# Altium project FMC_130MSPS.PrjPCB (part 1 of 2)
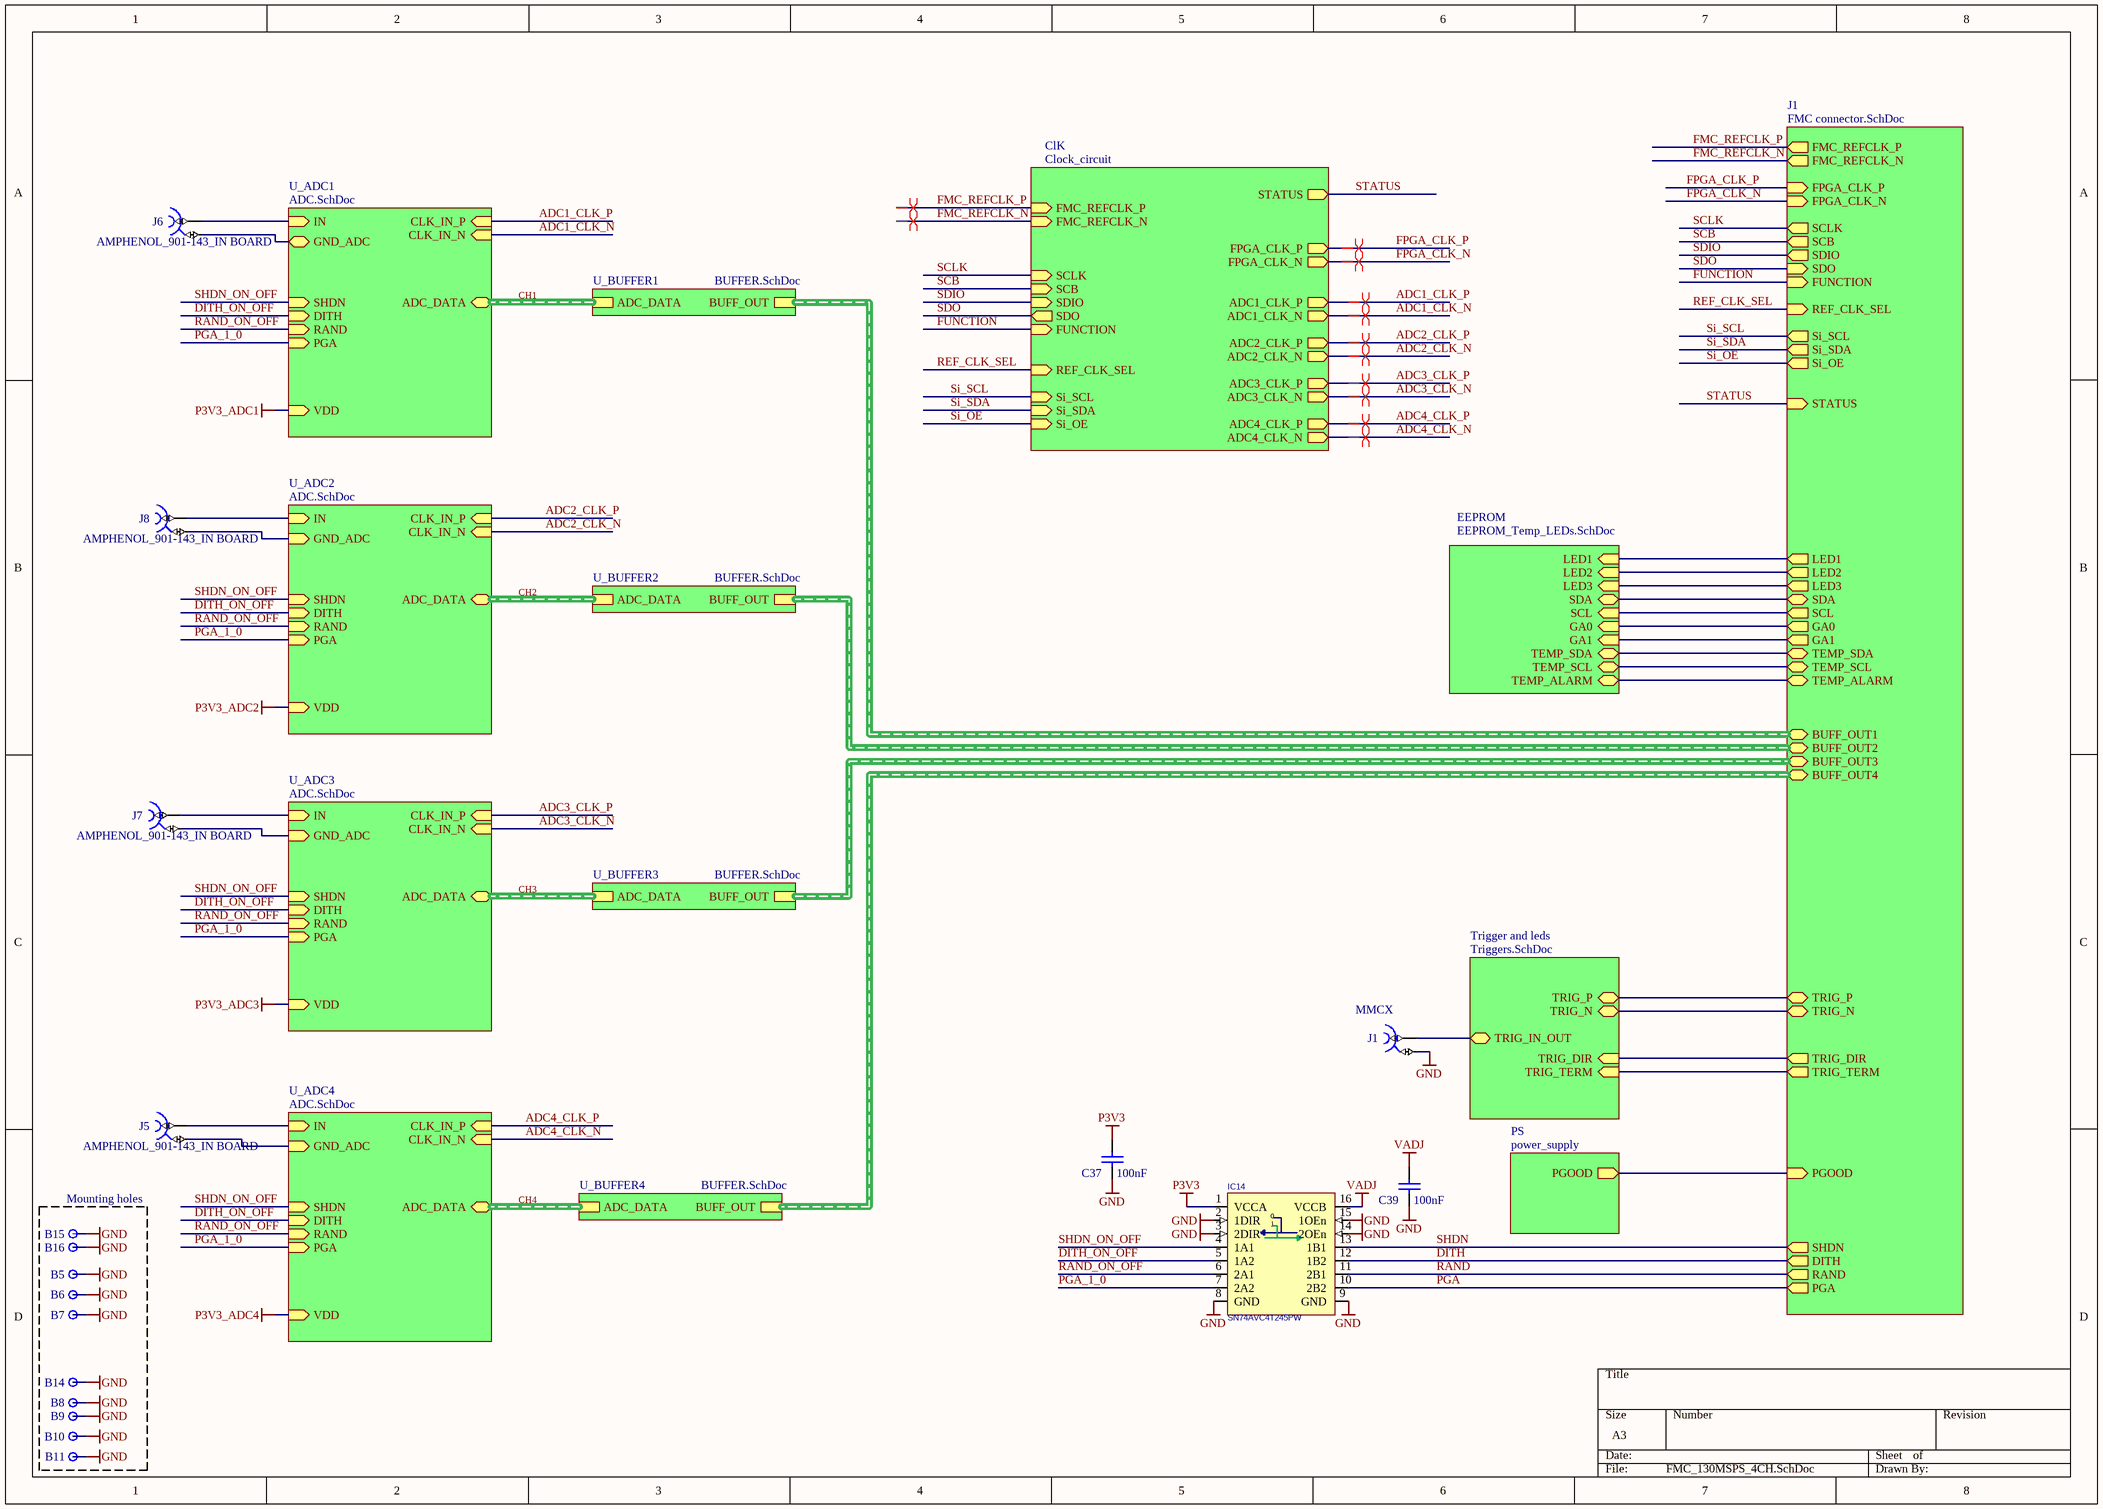
[diagram p0: FMC_130MSPS_4CH.SchDoc]
4 sheets, 294 parts. Net scope: hierarchical (ports join the sheet entries above them; power ports are global).
Board file: FMC_ADC_130M_16B_4CHv4.PcbDoc
Sheets:
  FMC_130MSPS_4CH.SchDoc
    ClK = Clock_circuit.SchDoc
    EEPROM = EEPROM_Temp_LEDs.SchDoc
    U_ADC1 = ADC.SchDoc
    U_ADC2 = ADC.SchDoc
    U_ADC3 = ADC.SchDoc
    U_ADC4 = ADC.SchDoc

## Sheet FMC_130MSPS_4CH.SchDoc
size A3

### Parts
B5  Plated Hole  [MTG240_400]  (value not drawn)  (no BOM)
B6  Plated Hole  [MTG240_400]  (value not drawn)  (no BOM)
B7  Plated Hole  [MTG240_400]  (value not drawn)  (no BOM)
B8  Plated Hole  [MTG240_400]  (value not drawn)  (no BOM)
B9  Plated Hole  [MTG240_400]  (value not drawn)  (no BOM)
B10  Plated Hole  [MTG240_400]  (value not drawn)  (no BOM)
B11  Plated Hole  [MTG240_400]  (value not drawn)  (no BOM)
B14  Plated Hole  [MTG240_400]  (value not drawn)  (no BOM)
B15  Plated Hole  [MTG240_400]  (value not drawn)  (no BOM)
B16  Plated Hole  [MTG240_400]  (value not drawn)  (no BOM)
C37  100nF  [CAPC0603X33N]
C39  100nF  [CAPC0603X33N]
IC14  SN74AVC4T245PW  [TSSOP-16]
J1  Family: MMCX  [HUBER-SUHNER_85_MMCX-50-0-1/111 OH]  (hidden comment: Coax_1Female_1Shield)
J5  AMPHENOL_901-143_IN BOARD  [AMPHENOL_901-143_IN BOARD]
J6  AMPHENOL_901-143_IN BOARD  [AMPHENOL_901-143_IN BOARD]
J7  AMPHENOL_901-143_IN BOARD  [AMPHENOL_901-143_IN BOARD]
J8  AMPHENOL_901-143_IN BOARD  [AMPHENOL_901-143_IN BOARD]

### Blocks framed on the sheet
Mounting holes: B5-B11 B14-B16

### Sub-sheets
ClK = Clock_circuit: FPGA_CLK_P (out), FPGA_CLK_N (out), Si_SDA (in), Si_SCL (in), Si_OE (in), ADC1_CLK_P (out), ADC1_CLK_N (out), ADC2_CLK_P (out), ADC2_CLK_N (out), ADC3_CLK_P (out), ADC3_CLK_N (out), ADC4_CLK_P (out), ADC4_CLK_N (out), SCLK (in), SCB (in), SDIO (in), SDO (out), STATUS (out), FUNCTION (in), FMC_REFCLK_P (in), FMC_REFCLK_N (in), REF_CLK_SEL (in)
EEPROM = EEPROM_Temp_LEDs.SchDoc: LED1 (in), LED2 (in), SDA (bidir), SCL (in), GA0 (in), GA1 (in), LED3 (in), TEMP_SDA (bidir), TEMP_SCL (bidir), TEMP_ALARM (bidir)
J1 = FMC connector.SchDoc (file not in this document): BUFF_OUT1 (harness BUFF_OUT), BUFF_OUT2 (harness BUFF_OUT), BUFF_OUT4 (harness BUFF_OUT), BUFF_OUT3 (harness BUFF_OUT), SHDN (out), DITH (out), RAND (out), PGA (out), PGOOD (in), TRIG_DIR (out), TRIG_TERM (out), FMC_REFCLK_P (out), FMC_REFCLK_N (out), Si_SDA (out), Si_SCL (out), Si_OE (out), SCLK (out), SCB (out), SDIO (out), SDO (in), FUNCTION (in), STATUS (in), FPGA_CLK_P (in), FPGA_CLK_N (in), TRIG_N (bidir), TRIG_P (bidir), REF_CLK_SEL (in), LED1 (out), LED2 (out), SDA (bidir), SCL (out), GA0 (out), GA1 (out), LED3 (out), TEMP_SDA (bidir), TEMP_SCL (bidir), TEMP_ALARM (bidir)
PS = power_supply (file not in this document): PGOOD (out)
Trigger and leds = Triggers.SchDoc (file not in this document): TRIG_DIR (in), TRIG_N (bidir), TRIG_P (bidir), TRIG_TERM (in), TRIG_IN_OUT (bidir)
U_ADC1 = ADC.SchDoc: SHDN (in), IN (in), DITH (in), RAND (in), VDD, CLK_IN_P (in), CLK_IN_N (in), PGA (in), ADC_DATA (harness ADC_DATA), GND_ADC
U_ADC2 = ADC.SchDoc: SHDN (in), IN (in), DITH (in), RAND (in), VDD, CLK_IN_P (in), CLK_IN_N (in), PGA (in), ADC_DATA (harness ADC_DATA), GND_ADC (in)
U_ADC3 = ADC.SchDoc: SHDN (in), IN (in), DITH (in), RAND (in), VDD, CLK_IN_P (in), CLK_IN_N (in), PGA (in), ADC_DATA (harness ADC_DATA), GND_ADC (in)
U_ADC4 = ADC.SchDoc: SHDN (in), IN (in), DITH (in), RAND (in), VDD, CLK_IN_P (in), CLK_IN_N (in), PGA (in), ADC_DATA (harness ADC_DATA), GND_ADC (in)
U_BUFFER1 = BUFFER.SchDoc (file not in this document): BUFF_OUT (harness BUFF_OUT), ADC_DATA (harness ADC_DATA)
U_BUFFER2 = BUFFER.SchDoc (file not in this document): BUFF_OUT (harness BUFF_OUT), ADC_DATA (harness ADC_DATA)
U_BUFFER3 = BUFFER.SchDoc (file not in this document): BUFF_OUT (harness BUFF_OUT), ADC_DATA (harness ADC_DATA)
U_BUFFER4 = BUFFER.SchDoc (file not in this document): BUFF_OUT (harness BUFF_OUT), ADC_DATA (harness ADC_DATA)

### Nets
GND: B5.1 B6.1 B7.1 B8.1 B9.1 B10.1 B11.1 B14.1 B15.1 B16.1 C37.1 C39.1 IC14.2(1DIR) IC14.3(2DIR) IC14.8(GND) IC14.9(GND) IC14.14(2OEn) IC14.15(1OEn) J1.2
P3V3: C37.2 IC14.1(VCCA)
VADJ: C39.2 IC14.16(VCCB)
ADC1_CLK_N: sheet ClK/ADC1_CLK_N, sheet U_ADC1/CLK_IN_N
ADC1_CLK_P: sheet ClK/ADC1_CLK_P, sheet U_ADC1/CLK_IN_P
ADC2_CLK_N: sheet ClK/ADC2_CLK_N, sheet U_ADC2/CLK_IN_N
ADC2_CLK_P: sheet ClK/ADC2_CLK_P, sheet U_ADC2/CLK_IN_P
ADC3_CLK_N: sheet ClK/ADC3_CLK_N, sheet U_ADC3/CLK_IN_N
ADC3_CLK_P: sheet ClK/ADC3_CLK_P, sheet U_ADC3/CLK_IN_P
ADC4_CLK_N: sheet ClK/ADC4_CLK_N, sheet U_ADC4/CLK_IN_N
ADC4_CLK_P: sheet ClK/ADC4_CLK_P, sheet U_ADC4/CLK_IN_P
DITH: IC14.12(1B2) ; sheet J1/DITH
DITH_ON_OFF: IC14.5(1A2) ; sheet U_ADC1/DITH, sheet U_ADC2/DITH, sheet U_ADC3/DITH, sheet U_ADC4/DITH
FMC_REFCLK_N: sheet J1/FMC_REFCLK_N, sheet ClK/FMC_REFCLK_N
FMC_REFCLK_P: sheet J1/FMC_REFCLK_P, sheet ClK/FMC_REFCLK_P
FPGA_CLK_N: sheet J1/FPGA_CLK_N, sheet ClK/FPGA_CLK_N
FPGA_CLK_P: sheet J1/FPGA_CLK_P, sheet ClK/FPGA_CLK_P
FUNCTION: sheet J1/FUNCTION, sheet ClK/FUNCTION
LED1: sheet J1/LED1, sheet EEPROM/LED1
LED2: sheet J1/LED2, sheet EEPROM/LED2
LED3: sheet J1/LED3, sheet EEPROM/LED3
PGA: IC14.10(2B2) ; sheet J1/PGA
PGA_1_0: IC14.7(2A2) ; sheet U_ADC1/PGA, sheet U_ADC2/PGA, sheet U_ADC3/PGA, sheet U_ADC4/PGA
RAND: IC14.11(2B1) ; sheet J1/RAND
RAND_ON_OFF: IC14.6(2A1) ; sheet U_ADC1/RAND, sheet U_ADC2/RAND, sheet U_ADC3/RAND, sheet U_ADC4/RAND
REF_CLK_SEL: sheet J1/REF_CLK_SEL, sheet ClK/REF_CLK_SEL
SCB: sheet J1/SCB, sheet ClK/SCB
SCL: sheet J1/SCL, sheet EEPROM/SCL
SCLK: sheet J1/SCLK, sheet ClK/SCLK
SDA: sheet J1/SDA, sheet EEPROM/SDA
SDIO: sheet J1/SDIO, sheet ClK/SDIO
SDO: sheet J1/SDO, sheet ClK/SDO
SHDN: IC14.13(1B1) ; sheet J1/SHDN
SHDN_ON_OFF: IC14.4(1A1) ; sheet U_ADC1/SHDN, sheet U_ADC2/SHDN, sheet U_ADC3/SHDN, sheet U_ADC4/SHDN
Si_OE: sheet J1/Si_OE, sheet ClK/Si_OE
Si_SCL: sheet J1/Si_SCL, sheet ClK/Si_SCL
Si_SDA: sheet J1/Si_SDA, sheet ClK/Si_SDA
STATUS: sheet J1/STATUS, sheet ClK/STATUS
TEMP_ALARM: sheet J1/TEMP_ALARM, sheet EEPROM/TEMP_ALARM
TEMP_SCL: sheet J1/TEMP_SCL, sheet EEPROM/TEMP_SCL
TEMP_SDA: sheet J1/TEMP_SDA, sheet EEPROM/TEMP_SDA
NetC1A_2: J6.2 ; sheet U_ADC1/GND_ADC
NetC1B_2: J8.2 ; sheet U_ADC2/GND_ADC
NetC1C_2: J7.2 ; sheet U_ADC3/GND_ADC
NetC1D_2: J5.2 ; sheet U_ADC4/GND_ADC
NetIC5_1: sheet J1/GA1, sheet EEPROM/GA1
NetIC5_2: sheet J1/GA0, sheet EEPROM/GA0
NetJ1_1: J1.1 ; sheet Trigger and leds/TRIG_IN_OUT
NetJ5_1: J5.1 ; sheet U_ADC4/IN
NetJ6_1: J6.1 ; sheet U_ADC1/IN
NetJ7_1: J7.1 ; sheet U_ADC3/IN
NetJ8_1: J8.1 ; sheet U_ADC2/IN
(unnamed): sheet PS/PGOOD, sheet J1/PGOOD
(unnamed): sheet J1/TRIG_DIR, sheet Trigger and leds/TRIG_DIR
(unnamed): sheet J1/TRIG_TERM, sheet Trigger and leds/TRIG_TERM
(unnamed): sheet J1/TRIG_N, sheet Trigger and leds/TRIG_N
(unnamed): sheet J1/TRIG_P, sheet Trigger and leds/TRIG_P

### Buses and harness runs
harness CH1 = sheet U_ADC1/ADC_DATA = sheet U_BUFFER1/ADC_DATA
harness CH2 = sheet U_ADC2/ADC_DATA = sheet U_BUFFER2/ADC_DATA
harness CH3 = sheet U_ADC3/ADC_DATA = sheet U_BUFFER3/ADC_DATA
harness CH4 = sheet U_ADC4/ADC_DATA = sheet U_BUFFER4/ADC_DATA
harness sheet J1/BUFF_OUT1 = sheet U_BUFFER1/BUFF_OUT
harness sheet J1/BUFF_OUT2 = sheet U_BUFFER2/BUFF_OUT
harness sheet J1/BUFF_OUT3 = sheet U_BUFFER3/BUFF_OUT
harness sheet J1/BUFF_OUT4 = sheet U_BUFFER4/BUFF_OUT

### Layout directives
differential pair: ADC1_CLK_N, ADC1_CLK_P, ADC2_CLK_N, ADC2_CLK_P, ADC3_CLK_N, ADC3_CLK_P, ADC4_CLK_N, ADC4_CLK_P, FMC_REFCLK_N, FMC_REFCLK_P, FPGA_CLK_N, FPGA_CLK_P

### Notes on the sheet
- (in symbol 74AVC4T245) 0

### Library data of the parts
B5-B11 B14-B16 = PLATED_HOLE2.4_PAD4.0: Single Terminal Socket; Part Description: Plated Through Hole: Hole Dia.=2.4mm Pad Dia.=4.0mm; Mounted: No; Table: Pads; Part Number: PLATED_HOLE2.4_PAD4.0; Component Type: Standard (No BOM); Pin Count: 1; Family: Plated Hole; Socket: No; SMD: No; Status: None; ComponentHeight: 0mm; Author: CERN DEM JMW; CreateDate: 2011-10-10; LatestRevisionDate: 2011-10-10; PackageDescription: Plated Through Hole: Hole Dia.=2.4mm Pad Dia.=4.0mm
C37 C39 = CC0201_100NF_6.3V_10%_X5R: Non-polarised capacitor; Part Description: SMD Multilayer Chip Ceramic Capacitor; Manufacturer: GENERIC; Manufacturer1 Part Number: 02016D104KAT2A; Voltage: 6.3V; TC: X5R; Tolerance: ±10%; Table: Capacitors SMD; Part Number: CC0201_100NF_6.3V_10%_X5R; Component Kind: Standard; Component Type: Standard; Pin Count: 2; Value: 100nF; Status: Not Recommended; Manufacturer Part Number: CC0201_100NF_6.3V_10%_X5R; Case: 0201; Mounted: Yes; Socket: No; SMD: Yes; Manufacturer1 Example: AVX; Manufacturer1 ComponentHeight: 0.33mm; HelpURL: \\cern.ch\dfs\Applications\Altium\Datasheets\CC0201_X5R_AVX.pdf; Author: CERN DEM JLC; CreateDate: 2007-12-03; LatestRevisionDate: 2007-12-03
IC14 = 74AVC4T245: 4-BIT DUAL-SUPPLY BUS TRANSCEIVER
J1 = HUBER-SUHNER_85_MMCX-50-0-1/111 OH: Part Description: MMCX 50 Ohms Right Angle PCB Jack; Manufacturer: HUBER+SUHNER; Table: Miscellaneous; Part Number: HUBER-SUHNER_85_MMCX-50-0-1/111 OH; Component Kind: Standard; Component Type: Standard; Pin Count: 2; Mounted: Yes; Socket: No; SMD: No; Status: None; Manufacturer Part Number: 85_MMCX-50-0-1/111 OH; ComponentHeight: 9.6mm; HelpURL: \\cern.ch\dfs\Applications\Altium\Datasheets\HUBER-SUHNER_85_MMCX-50-0-1-111 OH.pdf; Author: CERN DEM JLC; CreateDate: 4/10/2011; LatestRevisionDate: 4/10/2011

## Sheet Clock_circuit.SchDoc
size A3
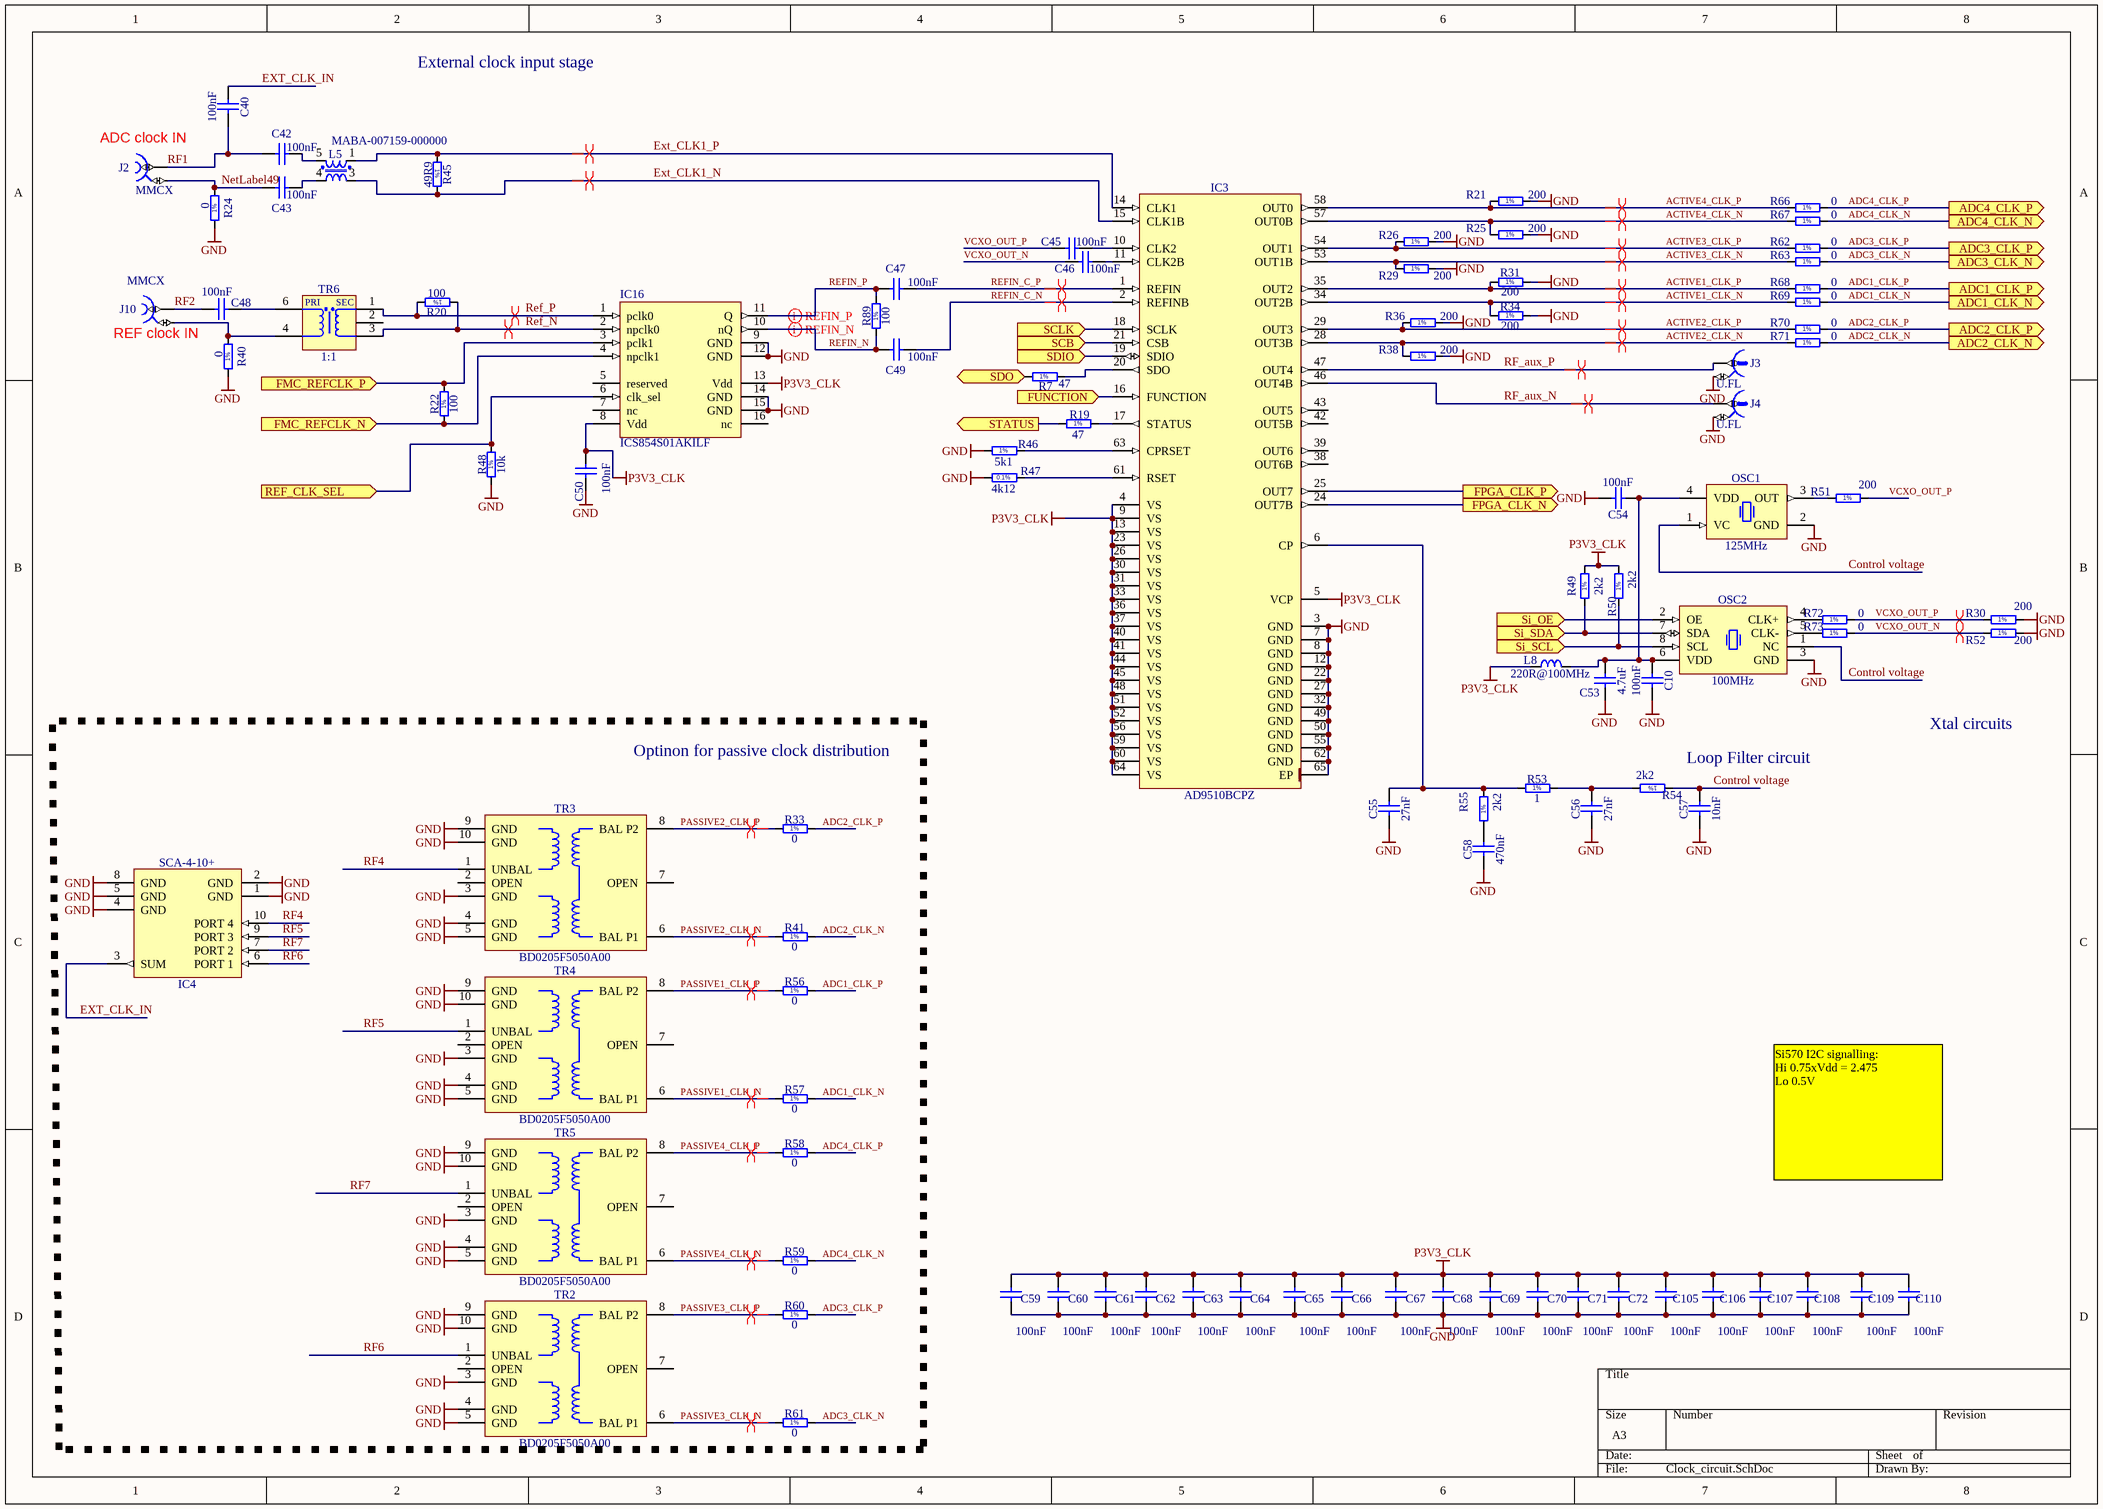
[diagram p1: Clock_circuit.SchDoc]

### Parts
C10  100nF  [CAPC0603X33N]
C40  100nF  [CAPC0603X33N]
C42  100nF  [CAPC0603X33N]
C43  100nF  [CAPC0603X33N]
C45  100nF  [CAPC0603X33N]
C46  100nF  [CAPC0603X33N]
C47  100nF  [CAPC0603X33N]
C48  100nF  [CAPC0603X33N]
C49  100nF  [CAPC0603X33N]
C50  100nF  [CAPC0603X33N]
C53  4.7uF  [CAPC1608X87N]
C54  100nF  [CAPC0603X33N]
C55  27nF  [CAPC1608X87N]
C56  27nF  [CAPC1608X87N]
C57  10nF  [CAPC1608X87N]
C58  470nF  [CAPC1608X87N]
C59  100nF  [CAPC0603X33N]
C60  100nF  [CAPC0603X33N]
C61  100nF  [CAPC0603X33N]
C62  100nF  [CAPC0603X33N]
C63  100nF  [CAPC0603X33N]
C64  100nF  [CAPC0603X33N]
C65  100nF  [CAPC0603X33N]
C66  100nF  [CAPC0603X33N]
C67  100nF  [CAPC0603X33N]
C68  100nF  [CAPC0603X33N]
C69  100nF  [CAPC0603X33N]
C70  100nF  [CAPC0603X33N]
C71  100nF  [CAPC0603X33N]
C72  100nF  [CAPC0603X33N]
C105  100nF  [CAPC0603X33N]
C106  100nF  [CAPC0603X33N]
C107  100nF  [CAPC0603X33N]
C108  100nF  [CAPC0603X33N]
C109  100nF  [CAPC0603X33N]
C110  100nF  [CAPC0603X33N]
IC3  AD9510BCPZ  [QFN50P900X900X100-65N-S485]
IC4  SCA-4-10+  [MINI-CIRCUITS_DZ943]
IC16  Manufacturer Part Number: ICS854S01AKILF  [QFN127P600-8N]  (hidden comment: ICS854S015CKI-01LF)
J2  Family: MMCX  [HUBER-SUHNER_85_MMCX-50-0-1/111 OH]  (hidden comment: Coax_1Female_1Shield)
J3  U.FL  [HIROSE_U.FL-R-SMT-1(10)]
J4  U.FL  [HIROSE_U.FL-R-SMT-1(10)]
J10  Family: MMCX  [HUBER-SUHNER_85_MMCX-50-0-1/111 OH]  (hidden comment: Coax_1Female_1Shield)
L5  MABA-007159-000000  [XFMR_MA-COM_SM-22 (H260)]
L8  220R@100MHz  [INDC1005X55N]
OSC1  125MHz  [OSC_CRYSTEK_CVHD-950]
OSC2  100MHz  [OSC_SILICON-LAB_SI570]
R7  47  [RESC1005X40N]
R19  47  [RESC1005X40N]
R20  100  [RESC1005X40N]
R21  200  [RESC1005X40N]
R22  100  [RESC1005X40N]
R24  0  [RESC1005X40N]
R25  200  [RESC1005X40N]
R26  200  [RESC1005X40N]
R29  200  [RESC1005X40N]
R30  200  [RESC1005X40N]
R31  200  [RESC1005X40N]
R33  0  [RESC1005X40N]
R34  200  [RESC1005X40N]
R36  200  [RESC1005X40N]
R38  200  [RESC1005X40N]
R40  0  [RESC1005X40N]
R41  0  [RESC1005X40N]
R45  49R9  [RESC1005X40N]
R46  5k1  [RESC1005X40N]
R47  4k12  [RESC1608X55N]
R48  10k  [RESC1005X40N]
R49  2k2  [RESC1005X40N]
R50  2k2  [RESC1005X40N]
R51  200  [RESC1005X40N]
R52  200  [RESC1005X40N]
R53  1  [RESC1005X40N]
R54  2k2  [RESC1005X40N]
R55  2k2  [RESC1005X40N]
R56  0  [RESC1005X40N]
R57  0  [RESC1005X40N]
R58  0  [RESC1005X40N]
R59  0  [RESC1005X40N]
R60  0  [RESC1005X40N]
R61  0  [RESC1005X40N]
R62  0  [RESC1005X40N]
R63  0  [RESC1005X40N]
R66  0  [RESC1005X40N]
R67  0  [RESC1005X40N]
R68  0  [RESC1005X40N]
R69  0  [RESC1005X40N]
R70  0  [RESC1005X40N]
R71  0  [RESC1005X40N]
R72  0  [RESC1005X40N]
R73  0  [RESC1005X40N]
R89  100  [RESC1005X40N]
TR2  BD0205F5050A00  [XFMR_ANAREN_BD0205F5050A00]
TR3  BD0205F5050A00  [XFMR_ANAREN_BD0205F5050A00]
TR4  BD0205F5050A00  [XFMR_ANAREN_BD0205F5050A00]
TR5  BD0205F5050A00  [XFMR_ANAREN_BD0205F5050A00]
TR6  1:1  [XFMR_MINI-CIRCUITS_AT224-1]

### Ports
ADC1_CLK_N (out), ADC1_CLK_P (out), ADC2_CLK_N (out), ADC2_CLK_P (out), ADC3_CLK_N (out), ADC3_CLK_P (out), ADC4_CLK_N (out), ADC4_CLK_P (out), FMC_REFCLK_N (in), FMC_REFCLK_P (in), FPGA_CLK_N (out), FPGA_CLK_P (out), FUNCTION (in), REF_CLK_SEL (in), SCB (in), SCLK (in), SDIO (in), SDO (out), Si_OE (in), Si_SCL (in), Si_SDA (in), STATUS (out)

### Nets
GND: C10.2 C50.2 C53.1 C54.2 C55.1 C56.1 C57.1 C58.1 C59.1 C60.1 C61.1 C62.1 C63.1 C64.1 C65.1 C66.1 C67.1 C68.1 C69.1 C70.1 C71.1 C72.1 C105.1 C106.1 C107.1 C108.1 C109.1 C110.1 IC3.3(GND) IC3.7(GND) IC3.8(GND) IC3.12(GND) IC3.22(GND) IC3.27(GND) IC3.32(GND) IC3.49(GND) IC3.50(GND) IC3.55(GND) IC3.62(GND) IC3.65(EP) IC4.1(GND) IC4.2(GND) IC4.4(GND) IC4.5(GND) IC4.8(GND) IC16.9(GND) IC16.12(GND) IC16.14(GND) IC16.15(GND) J3.2 J4.2 OSC1.2(GND) OSC2.3(GND) R21.2 R24.1 R25.2 R26.2 R29.2 R30.2 R31.2 R34.2 R36.2 R38.2 R40.1 R46.1 R47.1 R48.1 R52.2 TR2.3(GND) TR2.4(GND) TR2.5(GND) TR2.9(GND) TR2.10(GND) TR3.3(GND) TR3.4(GND) TR3.5(GND) TR3.9(GND) TR3.10(GND) TR4.3(GND) TR4.4(GND) TR4.5(GND) TR4.9(GND) TR4.10(GND) TR5.3(GND) TR5.4(GND) TR5.5(GND) TR5.9(GND) TR5.10(GND)
P3V3_CLK: C50.1 C59.2 C60.2 C61.2 C62.2 C63.2 C64.2 C65.2 C66.2 C67.2 C68.2 C69.2 C70.2 C71.2 C72.2 C105.2 C106.2 C107.2 C108.2 C109.2 C110.2 IC3.4(VS) IC3.5(VCP) IC3.9(VS) IC3.13(VS) IC3.23(VS) IC3.26(VS) IC3.30(VS) IC3.31(VS) IC3.33(VS) IC3.36(VS) IC3.37(VS) IC3.40(VS) IC3.41(VS) IC3.44(VS) IC3.45(VS) IC3.48(VS) IC3.51(VS) IC3.52(VS) IC3.56(VS) IC3.59(VS) IC3.60(VS) IC3.64(VS) IC16.8(Vdd) IC16.13(Vdd) L8.1 R49.2 R50.2
ACTIVE1_CLK_N: IC3.34(OUT2B) R34.1 R69.1
ACTIVE1_CLK_P: IC3.35(OUT2) R31.1 R68.1
ACTIVE2_CLK_N: IC3.28(OUT3B) R38.1 R71.1
ACTIVE2_CLK_P: IC3.29(OUT3) R36.1 R70.1
ACTIVE3_CLK_N: IC3.53(OUT1B) R29.1 R63.1
ACTIVE3_CLK_P: IC3.54(OUT1) R26.1 R62.1
ACTIVE4_CLK_N: IC3.57(OUT0B) R25.1 R67.1
ACTIVE4_CLK_P: IC3.58(OUT0) R21.1 R66.1
ADC1_CLK_N: R57.2 R69.2 ; port ADC1_CLK_N
ADC1_CLK_P: R56.2 R68.2 ; port ADC1_CLK_P
ADC2_CLK_N: R41.2 R71.2 ; port ADC2_CLK_N
ADC2_CLK_P: R33.2 R70.2 ; port ADC2_CLK_P
ADC3_CLK_N: R61.2 R63.2 ; port ADC3_CLK_N
ADC3_CLK_P: R60.2 R62.2 ; port ADC3_CLK_P
ADC4_CLK_N: R59.2 R67.2 ; port ADC4_CLK_N
ADC4_CLK_P: R58.2 R66.2 ; port ADC4_CLK_P
Control voltage: C57.2 OSC1.1(VC) OSC2.1(NC) R54.1
Ext_CLK1_N: IC3.15(CLK1B) L5.3 R45.2
Ext_CLK1_P: IC3.14(CLK1) L5.1 R45.1
EXT_CLK_IN: C40.1 IC4.3(SUM)
FMC_REFCLK_N: IC16.4(npclk1) R22.1 ; port FMC_REFCLK_N
FMC_REFCLK_P: IC16.3(pclk1) R22.2 ; port FMC_REFCLK_P
FPGA_CLK_N: IC3.24(OUT7B) ; port FPGA_CLK_N
FPGA_CLK_P: IC3.25(OUT7) ; port FPGA_CLK_P
FUNCTION: IC3.16(FUNCTION) ; port FUNCTION
NetLabel49: C43.2 J2.2 R24.2
PASSIVE1_CLK_N: R57.1 TR4.6(BAL_P1)
PASSIVE1_CLK_P: R56.1 TR4.8(BAL_P2)
PASSIVE2_CLK_N: R41.1 TR3.6(BAL_P1)
PASSIVE2_CLK_P: R33.1 TR3.8(BAL_P2)
PASSIVE3_CLK_N: R61.1 TR2.6(BAL_P1)
PASSIVE3_CLK_P: R60.1 TR2.8(BAL_P2)
PASSIVE4_CLK_N: R59.1 TR5.6(BAL_P1)
PASSIVE4_CLK_P: R58.1 TR5.8(BAL_P2)
REF_CLK_SEL: IC16.6(clk_sel) R48.2 ; port REF_CLK_SEL
Ref_N: IC16.2(npclk0) R20.1 TR6.3(S)
Ref_P: IC16.1(pclk0) R20.2 TR6.1(SDOT)
REFIN_C_N: C49.1 IC3.2(REFINB)
REFIN_C_P: C47.1 IC3.1(REFIN)
REFIN_N: C49.2 IC16.10(nQ) R89.1
REFIN_P: C47.2 IC16.11(Q) R89.2
RF1: C40.2 C42.2 J2.1
RF2: C48.2 J10.1
RF4: IC4.10(PORT_4) TR3.1(UNBAL)
RF5: IC4.9(PORT_3) TR4.1(UNBAL)
RF6: IC4.6(PORT_1) TR2.1(UNBAL)
RF7: IC4.7(PORT_2) TR5.1(UNBAL)
RF_aux_N: IC3.46(OUT4B) J4.1
RF_aux_P: IC3.47(OUT4) J3.1
SCB: IC3.21(CSB) ; port SCB
SCLK: IC3.18(SCLK) ; port SCLK
SDIO: IC3.19(SDIO) ; port SDIO
SDO: R7.1 ; port SDO
Si_OE: OSC2.2(OE) ; port Si_OE
Si_SCL: OSC2.8(SCL) R50.1 ; port Si_SCL
Si_SDA: OSC2.7(SDA) R49.1 ; port Si_SDA
STATUS: R19.1 ; port STATUS
VCXO_OUT_N: C46.2 R52.1 R73.2
VCXO_OUT_P: C45.2 R30.1 R51.2 R72.2
NetC10_1: C10.1 C53.2 C54.1 L8.2 OSC1.4(VDD) OSC2.6(VDD)
NetC42_1: C42.1 L5.5
NetC43_1: C43.1 L5.4
NetC45_1: C45.1 IC3.10(CLK2)
NetC46_1: C46.1 IC3.11(CLK2B)
NetC48_1: C48.1 TR6.6(PDOT)
NetC55_2: C55.2 IC3.6(CP) R53.1 R55.2
NetC56_2: C56.2 R53.2 R54.2
NetC58_2: C58.2 R55.1
NetIC3_17: IC3.17(STATUS) R19.2
NetIC3_20: IC3.20(SDO) R7.2
NetIC3_61: IC3.61(RSET) R47.2
NetIC3_63: IC3.63(CPRSET) R46.2
NetJ10_2: J10.2 R40.2 TR6.4(P)
NetOSC1_3: OSC1.3(OUT) R51.1
NetOSC2_4: OSC2.4(CLK+) R72.1
NetOSC2_5: OSC2.5(CLK-) R73.1

Not connected (* = marked no-connect by the designer): IC3 38(OUT6B) 39(OUT6) 42(OUT5B) 43(OUT5); IC16 5(reserved) 7(nc) 16(nc); TR2 2(OPEN) 7(OPEN); TR3 2(OPEN) 7(OPEN); TR4 2(OPEN) 7(OPEN); TR5 2(OPEN) 7(OPEN); TR6 2(NU)

### Layout directives
differential pair: ACTIVE1_CLK_N, ACTIVE1_CLK_P, ACTIVE2_CLK_N, ACTIVE2_CLK_P, ACTIVE3_CLK_N, ACTIVE3_CLK_P, ACTIVE4_CLK_N, ACTIVE4_CLK_P, Ext_CLK1_N, Ext_CLK1_P, PASSIVE1_CLK_N, PASSIVE1_CLK_P, PASSIVE2_CLK_N, PASSIVE2_CLK_P, PASSIVE3_CLK_N, PASSIVE3_CLK_P, PASSIVE4_CLK_N, PASSIVE4_CLK_P, Ref_N, Ref_P, REFIN_C_N, REFIN_C_P, REFIN_N, REFIN_P, RF_aux_N, RF_aux_P, VCXO_OUT_N, VCXO_OUT_P

### Notes on the sheet
- External clock input stage
- (near J2) ADC clock IN
- (near J10) REF clock IN
- Optinon for passive clock distribution
- Loop Filter circuit
- Xtal circuits
- Si570 I2C signalling:
  Hi 0.75xVdd = 2.475
  Lo 0.5V
- (in symbol R0402_0R_JUMPER) 1%
- (in symbol R0402_1R_1%_0.0625W_200PPM) 1%
- (in symbol R0402_2K2_1%_0.0625W_100PPM) 1%
- (in symbol R0402_5K1_1%_0.0625W_100PPM) 1%
- (in symbol R0402_10K_1%_0.0625W_100PPM) 1%
- (in symbol R0402_47R_1%_0.0625W_100PPM) 1%
- (in symbol R0402_100R_1%_0.0625W_100PPM) 1%
- (in symbol R0402_200R_1%_0.0625W_100PPM) 1%
- (in symbol R0603_4K12_0.1%_0.063W_10PPM) 0.1%
- (in symbol XFMR_MINI-CIRCUITS_TC1-1+) PRI; SEC

### Library data of the parts
C10 C40 C42 C43 C45-C50 C54 C59-C72 C105-C110 = CC0201_100NF_6.3V_10%_X5R: as C37 on sheet FMC_130MSPS_4CH; Part Number: CC0201_100NF_6.3V_10%_X5R; Component Kind: Standard; Component Type: Standard; Pin Count: 2; Value: 100nF; Status: Not Recommended; Manufacturer Part Number: CC0201_100NF_6.3V_10%_X5R; Case: 0201; Mounted: Yes; Socket: No; SMD: Yes; Manufacturer1 Example: AVX; Manufacturer1 ComponentHeight: 0.33mm; HelpURL: \\cern.ch\dfs\Applications\Altium\Datasheets\CC0201_X5R_AVX.pdf; Author: CERN DEM JLC
  C10 C40 C42 C43 C45-C47 C49 C54: CreateDate: 3/12/2007; LatestRevisionDate: 3/12/2007
  C48 C50 C59-C72 C105-C110: CreateDate: 2007-12-03; LatestRevisionDate: 2007-12-03
C53 = CC0603_4.7UF_6.3V_10%_X5R: Non-polarised capacitor; Part Description: SMD Multilayer Chip Ceramic Capacitor; Manufacturer: GENERIC; Manufacturer1 Part Number: 225520613672; Voltage: 6.3V; TC: X5R; Tolerance: ±10%; Table: Capacitors SMD; Part Number: CC0603_4.7UF_6.3V_10%_X5R; Component Kind: Standard; Component Type: Standard; Pin Count: 2; Value: 4.7uF; Status: Preferred; Manufacturer Part Number: CC0603_4.7uF_6.3V_10%_X5R; Case: 0603; Mounted: Yes; Socket: No; SMD: Yes; Manufacturer1 Example: PHYCOMP; Manufacturer1 ComponentHeight: 0.87mm; HelpURL: \\cern.ch\dfs\Applications\Altium\Datasheets\CC0805_X5R_PHYCOMP_HC.pdf; Author: CERN DEM JLC; CreateDate: 3/12/2007; LatestRevisionDate: 3/12/2007
C55 C56 = CC0603_27NF_25V_10%_X7R: Non-polarised capacitor; Part Description: SMD Multilayer Chip Ceramic Capacitor; Manufacturer: GENERIC; Manufacturer1 Part Number: 223891615642; Voltage: 25V; TC: X7R; Tolerance: ±10%; Table: Capacitors SMD; Part Number: CC0603_27NF_25V_10%_X7R; Component Kind: Standard; Component Type: Standard; Pin Count: 2; Value: 27nF; Status: Preferred; Manufacturer Part Number: CC0603_27NF_25V_10%_X7R; Case: 0603; Mounted: Yes; Socket: No; SMD: Yes; Manufacturer1 Example: PHYCOMP; Manufacturer1 ComponentHeight: 0.87mm; HelpURL: \\cern.ch\dfs\Applications\Altium\Datasheets\CC0603_X7R_PHYCOMP.pdf; Author: CERN DEM JLC; CreateDate: 3/12/2007; LatestRevisionDate: 3/12/2007
C57 = CC0603_10NF_50V_10%_X7R: Non-polarised capacitor; Part Description: SMD Multilayer Chip Ceramic Capacitor; Manufacturer: GENERIC; Manufacturer1 Part Number: 223858615636; Voltage: 50V; TC: X7R; Tolerance: ±10%; Table: Capacitors SMD; Part Number: CC0603_10NF_50V_10%_X7R; Component Kind: Standard; Component Type: Standard; Pin Count: 2; Value: 10nF; Status: Preferred; Manufacturer Part Number: CC0603_10NF_50V_10%_X7R; Case: 0603; Mounted: Yes; Socket: No; SMD: Yes; Manufacturer1 Example: PHYCOMP; Manufacturer1 ComponentHeight: 0.87mm; HelpURL: \\cern.ch\dfs\Applications\Altium\Datasheets\CC0603_X7R_PHYCOMP.pdf; Author: CERN DEM JLC; CreateDate: 03/12/2007; LatestRevisionDate: 03/12/2007
C58 = CC0603_470NF_16V_10%_X5R: Non-polarised capacitor; Part Description: SMD Multilayer Chip Ceramic Capacitor; Manufacturer: GENERIC; Manufacturer1 Part Number: 223878613658; Voltage: 16V; TC: X5R; Tolerance: ±10%; Table: Capacitors SMD; Part Number: CC0603_470NF_16V_10%_X5R; Component Kind: Standard; Component Type: Standard; Pin Count: 2; Value: 470nF; Status: Preferred; Manufacturer Part Number: CC0603_470NF_16V_10%_X5R; Case: 0603; Mounted: Yes; Socket: No; SMD: Yes; Manufacturer1 Example: PHYCOMP; Manufacturer1 ComponentHeight: 0.87mm; HelpURL: \\cern.ch\dfs\Applications\Altium\Datasheets\CC0805_X5R_PHYCOMP_HC.pdf; Author: CERN DEM JLC; CreateDate: 03/12/2007; LatestRevisionDate: 03/12/2007
IC3 = AD9510BCPZ: 1.2 GHz Clock Distribution IC, PLL Core, Dividers, Delay Adjust, Eight Outputs; Manufacturer: ANALOG DEVICES; Table: Logic; Part Number: AD9510BCPZ; Component Kind: Standard; Component Type: Standard; Device: AD9510BCPZ; PackageDescription: QFN, 0.50mm Pitch, Square; 64 Pin, 9.00mm L X 9.00mm W X 1.00mm H Body (4.85 X 4.85mm Thermal Tab), IPC Medium Density; Part Description: 1.2 GHz Clock Distribution IC, PLL Core, Dividers, Delay Adjust, Eight Outputs; Manufacturer Part Number: AD9510BCPZ; Pin Count: 65; Case: QFN64; Mounted: Yes; Socket: No; SMD: Yes; ComponentHeight: 1.0mm; HelpURL: \\cern.ch\dfs\Applications\Altium\Datasheets\AD9510BCPZ.pdf; Author: CERN DEM JLC; CreateDate: 9/10/2012; LatestRevisionDate: 9/10/2012
IC4 = SCA-4-10+: 4 Way-0° 50 OHM 5 to 1000 MHz Power Splitter/Combiner; Part Description: 4 Way-0° 50 Ohms 5 to 1000 MHz Power Splitter/Combiner; Manufacturer: MINI-CIRCUITS; Table: Analog & Interface; Part Number: SCA-4-10+; Component Kind: Standard; Component Type: Standard; Device: SCA-4-10+; PackageDescription: MINI-CIRCUITS TDZ943 Case, 10 pin,  7.62mm W X 6.35mm L; Manufacturer Part Number: SCA-4-10+; Pin Count: 10; Mounted: Yes; Socket: No; SMD: Yes; ComponentHeight: 5.84mm; Author: CERN DEM JLC; HelpURL: \\cern.ch\dfs\Applications\Altium\Datasheets\SCA-4-10+.pdf; CreateDate: 3/11/2009; LatestRevisionDate: 27/4/2010
IC16 = ICS854S015CKI-01LF: 2:1 Differential-to-LVDS Multiplexer; Manufacturer: IDT, Integrated Device Technology Inc; Supplier 1: Digi-Key; RoHS: RoHS Compliant; Category: Undefined Category; Supplier Part Number: 800-2561-ND
J2 J10 = HUBER-SUHNER_85_MMCX-50-0-1/111 OH: as J1 on sheet FMC_130MSPS_4CH; Part Number: HUBER-SUHNER_85_MMCX-50-0-1/111 OH; Component Kind: Standard; Component Type: Standard; Pin Count: 2; Mounted: Yes; Socket: No; SMD: No; Status: None; Manufacturer Part Number: 85_MMCX-50-0-1/111 OH; ComponentHeight: 9.6mm; HelpURL: \\cern.ch\dfs\Applications\Altium\Datasheets\HUBER-SUHNER_85_MMCX-50-0-1-111 OH.pdf; Author: CERN DEM JLC; CreateDate: 2011-10-04; LatestRevisionDate: 2011-10-04
J3 J4 = HIROSE_U.FL-R-SMT-1(10): Part Description: Up to 6GHz Ultra Small Surface Mount Male Coaxial Connectors U.FL Series; Manufacturer: HIROSE (HRS); Table: Miscellaneous; Part Number: HIROSE_U.FL-R-SMT-1(10); Component Kind: Standard; Component Type: Standard; Pin Count: 2; Family: U.FL; Mounted: Yes; Socket: No; SMD: Yes; Status: None; Manufacturer Part Number: U.FL-R-SMT-1(10); ComponentHeight: 1.25mm; HelpURL: \\cern.ch\dfs\Applications\Altium\Datasheets\HIROSE_U.FL-R-SMT-1(10).pdf; Author: CERN DEM JLC; CreateDate: 24/3/2010; LatestRevisionDate: 24/3/2010
L5 = XFMR_MA-COM_MABA-007159-000000: MA-COM E-Serie RF 1:1 Transmission Line Ttransformer 4.5-3000MHz; Part Description: RF Transmission Line Ttransformer 4.5-3000MHz (E-Serie); Manufacturer: MA-COM TECHNOLOGY; Table: Transformers; Part Number: XFMR_MA-COM_MABA-007159-000000; Component Kind: Standard; Component Type: Standard; Pin Count: 5; Value: 1:1; Status: None; Manufacturer Part Number: MABA-007159-000000; Mounted: Yes; Socket: No; SMD: Yes; ComponentHeight: 2.6mm; HelpURL: \\cern.ch\dfs\Applications\Altium\Datasheets\XFMR_MA-COM_MABA-007159-000000.pdf; Author: CERN DEM JLC; CreateDate: 3/10/2012; LatestRevisionDate: 3/10/2012
L8 = IND0402_MURATA_BLM15HB221SN1: Inductor; Part Description: SMD EMIFIL Suppression Chip Ferrite Bead; Manufacturer: MURATA; Power: 250mA; Resistance: 1R; Tolerance: ±25%; Table: Inductors SMD; Part Number: IND0402_MURATA_BLM15HB221SN1; Component Kind: Standard; Component Type: Standard; Pin Count: 2; Value: 220R@100MHz; Status: None; Manufacturer Part Number: BLM15HB221SN1; Case: 0402; Mounted: Yes; Socket: No; SMD: Yes; ComponentHeight: 0.55mm; HelpURL: \\cern.ch\dfs\Applications\Altium\Datasheets\IND0402_MURATA_BLM15H.pdf; Author: CERN DEM JLC; CreateDate: 23/6/2009; LatestRevisionDate: 23/6/2009
OSC1 = OSC_125MHZ_CRYSTEK_CVHD-950-100.000: Oscillator 4 pins 1=VC 2=GND 3=OUT 4=VDD; Part Description: 3.3V, ±20ppm, 15pF, 0..70°C, CMOS Surface Mount Ultra-Low Noise Oscillator (CVHD-950 Serie); Manufacturer: CRYSTEK CRYSTAL; Table: Crystals & Oscillators; Part Number: OSC_125MHZ_CRYSTEK_CVHD-950-100.000; Component Kind: Standard; Component Type: Standard; PackageDescription: Oscillator, 5.08mm Pitch; 4 Pin, 14.2mm L X 9.14mm W X 5.3mm H, CVHD-950 Serie; Value: 125MHz; Manufacturer Part Number: CVHD-950-100.000; Pin Count: 4; Mounted: Yes; Socket: No; SMD: Yes; ComponentHeight: 5.3mm; HelpURL: \\cern.ch\dfs\Applications\Altium\Datasheets\OSC_CRYSTEK_CVHD-950.pdf; Author: CERN DEM JLC; CreateDate: 9/10/2012; LatestRevisionDate: 9/10/2012
OSC2 = OSC_10-280MHZ_SILICON-LAB_Si570BBC000121DG: Any-Rate I2C Programmable XO Oscillator Si570 Serie; Part Description: 10-280MHz 3.3V ±20ppm LVDS Any-Rate I2C Programmable XO Oscillator Si570 Serie; Manufacturer: SILICON LABS; Table: Crystals & Oscillators; Part Number: OSC_10-280MHZ_SILICON-LAB_Si570BBC000121DG; Component Kind: Standard; Component Type: Standard; PackageDescription: Oscillator Si570 Serie, 8 pins, 5x7mm; Value: 100MHz; Manufacturer Part Number: 570BBC000121DG; Pin Count: 8; Mounted: Yes; Socket: No; SMD: Yes; ComponentHeight: 1.85mm; HelpURL: \\cern.ch\dfs\Applications\Altium\Datasheets\OSC_SILICON-LAB_SI570.pdf; Author: CERN DEM JLC; CreateDate: 9/2/2010; LatestRevisionDate: 26/3/2012
R7 R19 = R0402_47R_1%_0.0625W_100PPM: Resistor - 1%; Part Description: General Purpose Thick Film Chip Resistor; Manufacturer: GENERIC; Manufacturer1 Part Number: 232270674709L; TC: ±100ppm/°C; Table: Resistors SMD; Part Number: R0402_47R_1%_0.0625W_100PPM; Component Kind: Standard; Component Type: Standard; Pin Count: 2; Value: 47; Status: Not recommended; Power: 0.0625W; Tolerance: ±1%; Manufacturer Part Number: R0402_47R_1%_0.0625W_100PPM; Case: 0402; Mounted: Yes; Socket: No; SMD: Yes; Manufacturer1 Example: YAGEO PHYCOMP; Manufacturer1 ComponentHeight: 0.4mm; HelpURL: \\cern.ch\dfs\Applications\Altium\Datasheets\R0402_Phycomp_RC0402.pdf; Author: CERN DEM JLC; CreateDate: 3/12/2007; LatestRevisionDate: 17/10/2012
R20 R22 R89 = R0402_100R_1%_0.0625W_100PPM: Resistor - 1%; Part Description: General Purpose Thick Film Chip Resistor; Manufacturer: GENERIC; Manufacturer1 Part Number: 232270671001L; TC: ±100ppm/°C; Table: Resistors SMD; Part Number: R0402_100R_1%_0.0625W_100PPM; Component Kind: Standard; Component Type: Standard; Pin Count: 2; Value: 100; Status: Not recommended; Power: 0.0625W; Tolerance: ±1%; Manufacturer Part Number: R0402_100R_1%_0.0625W_100PPM; Case: 0402; Mounted: Yes; Socket: No; SMD: Yes; Manufacturer1 Example: YAGEO PHYCOMP; Manufacturer1 ComponentHeight: 0.4mm; HelpURL: \\cern.ch\dfs\Applications\Altium\Datasheets\R0402_Phycomp_RC0402.pdf; Author: CERN DEM JLC; CreateDate: 3/12/2007; LatestRevisionDate: 17/10/2012
R21 R25 R26 R29-R31 R34 R36 R38 R51 R52 = R0402_200R_1%_0.0625W_100PPM: Resistor - 1%; Part Description: General Purpose Thick Film Chip Resistor; Manufacturer: GENERIC; Manufacturer1 Part Number: 232270672001L; TC: ±100ppm/°C; Table: Resistors SMD; Part Number: R0402_200R_1%_0.0625W_100PPM; Component Kind: Standard; Component Type: Standard; Pin Count: 2; Value: 200; Status: Not recommended; Power: 0.0625W; Tolerance: ±1%; Manufacturer Part Number: R0402_200R_1%_0.0625W_100PPM; Case: 0402; Mounted: Yes; Socket: No; SMD: Yes; Manufacturer1 Example: YAGEO PHYCOMP; Manufacturer1 ComponentHeight: 0.4mm; HelpURL: \\cern.ch\dfs\Applications\Altium\Datasheets\R0402_Phycomp_RC0402.pdf; Author: CERN DEM JLC; CreateDate: 3/12/2007; LatestRevisionDate: 17/10/2012
R24 R40 = R0402_0R_JUMPER: Resistor - 1%; Part Description: 1A (0.05R Max DC Resistance) Zero Ohm Jumper; Manufacturer: GENERIC; Manufacturer1 Part Number: 232270591001L; Table: Resistors SMD; Part Number: R0402_0R_JUMPER; Component Kind: Standard; Component Type: Standard; Pin Count: 2; Value: 0; Status: Not recommended; Manufacturer Part Number: R0402_0R_JUMPER; Case: 0402; Mounted: Yes; Socket: No; SMD: Yes; Manufacturer1 Example: YAGEO PHYCOMP; Manufacturer1 ComponentHeight: 0.4mm; HelpURL: \\cern.ch\dfs\Applications\Altium\Datasheets\R0402_Phycomp_RC0402.pdf; Author: CERN DEM JLC; CreateDate: 3/12/2007; LatestRevisionDate: 17/10/2012
R33 R41 R56-R63 R66-R73 = R0402_0R_JUMPER: Resistor - 1%; Part Description: 1A (0.05R Max DC Resistance) Zero Ohm Jumper; Manufacturer: GENERIC; Manufacturer1 Part Number: 232270591001; Table: Resistors SMD; Part Number: R0402_0R_JUMPER; Component Kind: Standard; Component Type: Standard; Pin Count: 2; Value: 0; Status: Not recommended; Manufacturer Part Number: R0402_0R_JUMPER; Case: 0402; Mounted: Yes; Socket: No; SMD: Yes; Manufacturer1 Example: PHYCOMP; Manufacturer1 ComponentHeight: 0.4mm; HelpURL: \\cern.ch\dfs\Applications\Altium\Datasheets\R0402_Phycomp_RC0402.pdf; Author: CERN DEM JLC; CreateDate: 2007-12-03; LatestRevisionDate: 2008-03-13
R45 = R0402_100R_1%_0.0625W_100PPM: Resistor - 1%; Part Number: R0402_49R9_1%_0.0625W_100PPM; Part Description: General Purpose Thick Film Chip Resistor; Manufacturer: GENERIC; Manufacturer1 Part Number: 232270671001L; TC: ±100ppm/°C; Table: Resistors SMD; Component Kind: Standard; Component Type: Standard; Pin Count: 2; Value: 49R9; Status: Not recommended; Power: 0.0625W; Tolerance: ±1%; Manufacturer Part Number: R0402_49R9_1%_0.0625W_100PPM; Case: 0402; Mounted: Yes; Socket: No; SMD: Yes; Manufacturer1 Example: YAGEO PHYCOMP; Manufacturer1 ComponentHeight: 0.4mm; HelpURL: \\cern.ch\dfs\Applications\Altium\Datasheets\R0402_Phycomp_RC0402.pdf; Author: CERN DEM JLC; CreateDate: 3/12/2007; LatestRevisionDate: 17/10/2012
R46 = R0402_5K1_1%_0.0625W_100PPM: Resistor - 1%; Part Description: General Purpose Thick Film Chip Resistor; Manufacturer: GENERIC; Manufacturer1 Part Number: 232270675102L; TC: ±100ppm/°C; Table: Resistors SMD; Part Number: R0402_5K1_1%_0.0625W_100PPM; Component Kind: Standard; Component Type: Standard; Pin Count: 2; Value: 5k1; Status: Not recommended; Power: 0.0625W; Tolerance: ±1%; Manufacturer Part Number: R0402_5K1_1%_0.0625W_100PPM; Case: 0402; Mounted: Yes; Socket: No; SMD: Yes; Manufacturer1 Example: YAGEO PHYCOMP; Manufacturer1 ComponentHeight: 0.4mm; HelpURL: \\cern.ch\dfs\Applications\Altium\Datasheets\R0402_Phycomp_RC0402.pdf; Author: CERN DEM JLC; CreateDate: 3/12/2007; LatestRevisionDate: 17/10/2012
R47 = R0603_4K12_0.1%_0.063W_10PPM: Resistor - 0.1%; Part Description: Thin Film Chip Resistor; Manufacturer: GENERIC; Manufacturer1 Part Number: RN73C1J4K12BTDF; Power: 0.063W; TC: ±10ppm; Table: Resistors SMD; Part Number: R0603_4K12_0.1%_0.063W_10PPM; Component Kind: Standard; Component Type: Standard; Pin Count: 2; Value: 4k12; Status: Not recommended; Tolerance: ±0.1%; Manufacturer Part Number: R0603_4K12_0.1%_0.063W_10PPM; Case: 0603; Mounted: Yes; Socket: No; SMD: Yes; Manufacturer1 Example: TYCO HOLSWORTHY; Manufacturer1 ComponentHeight: 0.5mm; HelpURL: \\cern.ch\dfs\Applications\Altium\Datasheets\R0603_Tyco_RN73.pdf; Author: CERN DEM JLC; CreateDate: 3/12/2007; LatestRevisionDate: 13/3/2008
R48 = R0402_10K_1%_0.0625W_100PPM: Resistor - 1%; Part Description: General Purpose Thick Film Chip Resistor; Manufacturer: GENERIC; Manufacturer1 Part Number: 232270671003L; TC: ±100ppm/°C; Table: Resistors SMD; Part Number: R0402_10K_1%_0.0625W_100PPM; Component Kind: Standard; Component Type: Standard; Pin Count: 2; Value: 10k; Status: Not recommended; Power: 0.0625W; Tolerance: ±1%; Manufacturer Part Number: R0402_10K_1%_0.0625W_100PPM; Case: 0402; Mounted: Yes; Socket: No; SMD: Yes; Manufacturer1 Example: YAGEO PHYCOMP; Manufacturer1 ComponentHeight: 0.4mm; HelpURL: \\cern.ch\dfs\Applications\Altium\Datasheets\R0402_Phycomp_RC0402.pdf; Author: CERN DEM JLC; CreateDate: 3/12/2007; LatestRevisionDate: 17/10/2012
R49 R50 R54 R55 = R0402_2K2_1%_0.0625W_100PPM: Resistor - 1%; Part Description: General Purpose Thick Film Chip Resistor; Manufacturer: GENERIC; Manufacturer1 Part Number: 232270672202L; TC: ±100ppm/°C; Table: Resistors SMD; Part Number: R0402_2K2_1%_0.0625W_100PPM; Component Kind: Standard; Component Type: Standard; Pin Count: 2; Value: 2k2; Status: Not recommended; Power: 0.0625W; Tolerance: ±1%; Manufacturer Part Number: R0402_2K2_1%_0.0625W_100PPM; Case: 0402; Mounted: Yes; Socket: No; SMD: Yes; Manufacturer1 Example: YAGEO PHYCOMP; Manufacturer1 ComponentHeight: 0.4mm; HelpURL: \\cern.ch\dfs\Applications\Altium\Datasheets\R0402_Phycomp_RC0402.pdf; Author: CERN DEM JLC; CreateDate: 3/12/2007; LatestRevisionDate: 17/10/2012
R53 = R0402_1R_1%_0.0625W_200PPM: Resistor - 1%; Part Description: General Purpose Thick Film Chip Resistor; Manufacturer: GENERIC; Manufacturer1 Part Number: 232270671008L; TC: ±200ppm/°C; Table: Resistors SMD; Part Number: R0402_1R_1%_0.0625W_200PPM; Component Kind: Standard; Component Type: Standard; Pin Count: 2; Value: 1; Status: Not recommended; Power: 0.0625W; Tolerance: ±1%; Manufacturer Part Number: R0402_1R_1%_0.0625W_200PPM; Case: 0402; Mounted: Yes; Socket: No; SMD: Yes; Manufacturer1 Example: YAGEO PHYCOMP; Manufacturer1 ComponentHeight: 0.4mm; HelpURL: \\cern.ch\dfs\Applications\Altium\Datasheets\R0402_Phycomp_RC0402.pdf; Author: CERN DEM JLC; CreateDate: 3/12/2007; LatestRevisionDate: 17/10/2012
TR2-TR5 = XFMR_ANAREN_BD0205F5050A00: 70MHz - 1000MHz Ultra Low Profile Sub-Miniature Balanced to Unbalanced Transformer; Manufacturer: ANAREN; Table: Transformers; Part Number: XFMR_ANAREN_BD0205F5050A00; Component Kind: Standard; Component Type: Standard; Pin Count: 10; Status: None; Part Description: 70MHz - 1000MHz Ultra Low Profile Sub-Miniature Balanced to Unbalanced Transformer; Manufacturer Part Number: BD0205F5050A00; Mounted: Yes; Socket: No; SMD: Yes; ComponentHeight: 2.60.91; HelpURL: \\cern.ch\dfs\Applications\Altium\Datasheets\XFMR_ANAREN_BD0205F5050A00.pdf; Author: CERN DEM JLC; CreateDate: 3/10/2012; LatestRevisionDate: 3/10/2012
TR6 = XFMR_MINI-CIRCUITS_TC1-1+: 50 Ohm  0.4 To 500MHz RF Transformers; Part Number: XFMR_MINI-CIRCUITS_TC1-1T+; Part Description: 50 Ohms 1.5 to 500 MHz RF Transformer; Manufacturer Part Number: TC1-1T+; Component Kind: Standard; Component Type: Standard; Pin Count: 5; Value: 1:1; Status: None; Manufacturer: MINI-CIRCUITS; Mounted: Yes; Socket: No; SMD: Yes; ComponentHeight: 4.06mm; HelpURL: \\cern.ch\dfs\Applications\Altium\Datasheets\XFMR_MINI-CIRCUITS_TC1-1+.pdf; Author: CERN DEM JLC; CreateDate: 2010-02-08; LatestRevisionDate: 2010-04-27; Table: Transformers

## Sheet EEPROM_Temp_LEDs.SchDoc
size A3
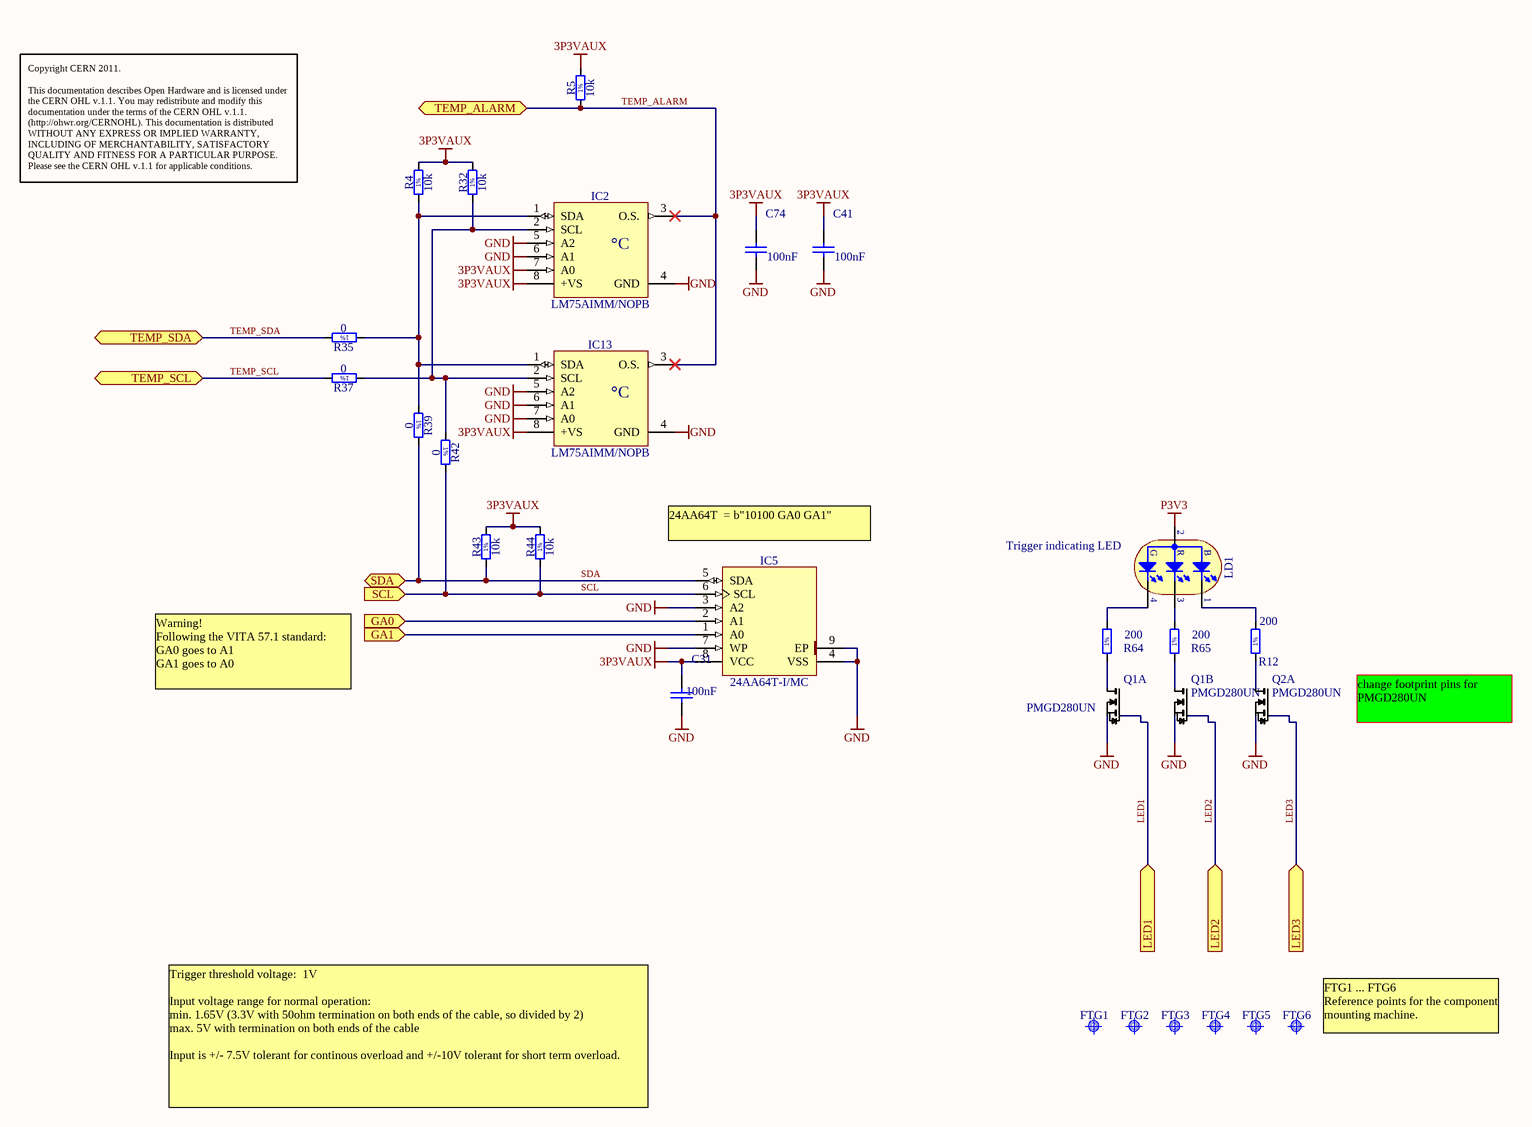
[diagram p2: EEPROM_Temp_LEDs.SchDoc]

### Parts
C31  100nF  [CAPC0603X33N]
C41  100nF  [CAPC0603X33N]
C74  100nF  [CAPC0603X33N]
FTG1  Use only in PCB  [FIDUCIAL_TOP_S100-200]  (value not drawn)
FTG2  Use only in PCB  [FIDUCIAL_TOP_S100-200]  (value not drawn)
FTG3  Use only in PCB  [FIDUCIAL_TOP_S100-200]  (value not drawn)
FTG4  Use only in PCB  [FIDUCIAL_TOP_S100-200]  (value not drawn)
FTG5  Use only in PCB  [FIDUCIAL_TOP_S100-200]  (value not drawn)
FTG6  Use only in PCB  [FIDUCIAL_TOP_S100-200]  (value not drawn)
IC2  LM75AIMM/NOPB  [SOP65P490X109-8N]
IC5  24AA64T-I/MC  [SON50P300X200X100-9N-S175X155]
IC13  LM75AIMM/NOPB  [SOP65P490X109-8N]
LD1  Blue/Red/Green  [LED_AVAGO_HSMF-C113]  (value not drawn)
Q1  PMGD280UN  [SOT-363]  (parts A,B of 2)
Q2  PMGD280UN  [SOT-363]  (part A of 2)
R4  10k  [RESC1005X40N]
R5  10k  [RESC1005X40N]
R12  200  [RESC1005X40N]
R32  10k  [RESC1005X40N]
R35  0  [RESC1005X40N]
R37  0  [RESC1005X40N]
R39  0  [RESC1005X40N]
R42  0  [RESC1005X40N]
R43  10k  [RESC1005X40N]
R44  10k  [RESC1005X40N]
R64  200  [RESC1005X40N]
R65  200  [RESC1005X40N]

### Ports
GA0 (in), GA1 (in), LED1 (in), LED2 (in), LED3 (in), SCL (in), SDA (bidir), TEMP_ALARM (bidir), TEMP_SCL (bidir), TEMP_SDA (bidir)

### Nets
3P3VAUX: C31.1 C41.1 C74.1 IC2.7(A0) IC2.8(+VS) IC5.8(VCC) IC13.8(+VS) R4.2 R5.2 R32.2 R43.2 R44.2
GND: C31.2 C41.2 C74.2 IC2.4(GND) IC2.5(A2) IC2.6(A1) IC5.3(A2) IC5.4(VSS) IC5.7(WP) IC5.9(EP) IC13.4(GND) IC13.5(A2) IC13.6(A1) IC13.7(A0) Q1.1(S1) Q1.4(S2) Q2.1(S1)
P3V3: LD1.2(AC)
LED1: Q1.2(G1) ; port LED1
LED2: Q1.5(G2) ; port LED2
LED3: Q2.2(G1) ; port LED3
SCL: IC5.6(SCL) R42.2 R44.1 ; port SCL
SDA: IC5.5(SDA) R39.2 R43.1 ; port SDA
TEMP_ALARM: IC2.3(O.S.) IC13.3(O.S.) R5.1 ; port TEMP_ALARM
TEMP_SCL: R37.2 ; port TEMP_SCL
TEMP_SDA: R35.2 ; port TEMP_SDA
NetIC2_1: IC2.1(SDA) IC13.1(SDA) R4.1 R35.1 R39.1
NetIC2_2: IC2.2(SCL) IC13.2(SCL) R32.1 R37.1 R42.1
NetIC5_1: IC5.1(A0) ; port GA1
NetIC5_2: IC5.2(A1) ; port GA0
NetLD1_1: LD1.1(CB) R12.2
NetLD1_3: LD1.3(CR) R65.2
NetLD1_4: LD1.4(CG) R64.2
NetQ1_3: Q1.3(D2) R65.1
NetQ1_6: Q1.6(D1) R64.1
NetQ2_6: Q2.6(D1) R12.1

### Notes on the sheet
- Copyright CERN 2011.
  This documentation describes Open Hardware and is licensed under the CERN OHL v.1.1. You may redistribute and modify this documentation under the terms of the CERN OHL v.1.1. (http://ohwr.org/CERNOHL). This documentation is distributed WITHOUT ANY EXPRESS OR IMPLIED WARRANTY, INCLUDING OF MERCHANTABILITY, SATISFACTORY QUALITY AND FITNESS FOR A PARTICULAR PURPOSE. Please see the CERN OHL v.1.1 for applicable conditions.
- (near IC5) 24AA64T  = b"10100 GA0 GA1"
- (near LD1) Trigger indicating LED
- Warning!
  Following the VITA 57.1 standard:
  GA0 goes to A1
  GA1 goes to A0
- change footprint pins for PMGD280UN
- (near FTG6) FTG1 ... FTG6
  Reference points for the component mounting machine.
- Trigger threshold voltage:  1V
  Input voltage range for normal operation:
  min. 1.65V (3.3V with 50ohm termination on both ends of the cable, so divided by 2)
  max. 5V with termination on both ends of the cable
  Input is +/- 7.5V tolerant for continous overload and +/-10V tolerant for short term overload.
- (in symbol LED_AVAGO_HSMF-C113) G; R; B
- (in symbol LM75AIMM/NOPB) °C
- (in symbol R0402_0R_JUMPER) 1%
- (in symbol R0402_10K_1%_0.0625W_100PPM) 1%
- (in symbol R0402_200R_1%_0.0625W_100PPM) 1%

### Library data of the parts
C31 C41 C74 = CC0201_100NF_6.3V_10%_X5R: as C37 on sheet FMC_130MSPS_4CH; Part Number: CC0201_100NF_6.3V_10%_X5R; Component Kind: Standard; Component Type: Standard; Pin Count: 2; Value: 100nF; Status: Not Recommended; Manufacturer Part Number: CC0201_100NF_6.3V_10%_X5R; Case: 0201; Mounted: Yes; Socket: No; SMD: Yes; Manufacturer1 Example: AVX; Manufacturer1 ComponentHeight: 0.33mm; HelpURL: \\cern.ch\dfs\Applications\Altium\Datasheets\CC0201_X5R_AVX.pdf; Author: CERN DEM JLC; CreateDate: 2007-12-03; LatestRevisionDate: 2007-12-03
FTG1-FTG6 = FIDUCIAL_TARGET_S100-200: Fiducial Target; Part Description: Square Fiducial Target, Top Layer, 1.0mm, Top Solder 2.0mm, Keepout =2.0mm; Mounted: No; Table: Pads; Part Number: FIDUCIAL_TARGET_S100-200; Component Kind: Standard (No BOM); Component Type: Standard (No BOM); Pin Count: 1; Family: Fiducial; Socket: No; SMD: Yes; Status: None; ComponentHeight: 0mm; Author: CERN DEM JLC; CreateDate: 9/2/2010; LatestRevisionDate: 4/4/2012; PackageDescription: Square Fiducial Target, Top Layer, 1.0mm, Top Solder 2.0mm, Keepout =2.0mm
IC2 IC13 = LM75AIMM/NOPB: Digital Temperature Sensor and Thermal Watchdog with Two-Wire Interface; Part Description: -25° to +100°C ±2°C Digital Temperature Sensor and Thermal Watchdog with Two-Wire Interface; Manufacturer: TEXAS INSTRUMENTS; Table: Sensors; Part Number: LM75AIMM/NOPB; Component Kind: Standard; Component Type: Standard; Device: LM75AIMM/NOPB; PackageDescription: SOP, 0.65mm pitch; 8 pin,3.00mm W X 3.00mm L X 1.09mm H bodyI, PC Medium Density; Manufacturer Part Number: LM75AIMM/NOPB; Pin Count: 8; Case: SSOP8; Mounted: Yes; Socket: No; SMD: Yes; ComponentHeight: 1.09mm; HelpURL: \\cern.ch\dfs\Applications\Altium\Datasheets\LM75AIMM-NOPB.pdf; Author: CERN DEM JLC; CreateDate: 2012-10-15; LatestRevisionDate: 2012-10-15
IC5 = 24AA64T-I/MC: 1.7-5.5V 64K I2C Serial EEPROM; Part Description: 1.7V-5.5V, 64K  (8K x 8-bit) I2C Serial EEPROM; Manufacturer: MICROCHIP TECHNOLOGY; Table: Logic; Part Number: 24AA64T-I/MC; Component Kind: Standard; Component Type: Standard; Device: 24AA64T-I/MC; PackageDescription: SON (DFN), 0.50mm pitch, 8 pin, 2mm X 3mm X 1.00mm H body (w/thermal tab 1.75 X 1.55mm),  IPC Medium Density; Manufacturer Part Number: 24AA64T-I/MC; Pin Count: 9; Case: DFN8; Mounted: Yes; Socket: No; SMD: Yes; ComponentHeight: 1.0mm; HelpURL: \\cern.ch\dfs\Applications\Altium\Datasheets\24AA64T-I-MC.pdf; Author: CERN DEM JLC; CreateDate: 18/11/2009; LatestRevisionDate: 24/1/2011
LD1 = LED_AVAGO_HSMF-C113: Tricolor LEDs 1 Cathode Blue, 2 Common Anode, 3 Cathode Red, 4 Cathode Green; Part Description: Right Angle Tricolor (Blue, Red, Green) Surface Mount ChipLED; Manufacturer: AVAGO TECHNOLOGIES; Table: LEDs & Displays; Part Number: LED_AVAGO_HSMF-C113; Component Kind: Standard; Component Type: Standard; Color: Blue/Red/Green; PackageDescription: Right Angle Tricolor Surface Mount ChipLED, Body 2.5x1mm; Manufacturer Part Number: HSMF-C113; Pin Count: 4; Mounted: Yes; Socket: No; SMD: Yes; ComponentHeight: 1mm; HelpURL: \\cern.ch\dfs\Applications\Altium\Datasheets\LED_AVAGO_HSMF-C113.pdf; Author: CERN DEM JLC; CreateDate: 29/9/2010; LatestRevisionDate: 29/9/2010
Q1 Q2 = Q_PMGD280UN: Dual NMOS 20V,08.A, 340mR, Vt=0.7V
R4 R5 R32 R43 R44 = R0402_10K_1%_0.0625W_100PPM: as R48 on sheet Clock_circuit; Part Number: R0402_10K_1%_0.0625W_100PPM; Component Kind: Standard; Component Type: Standard; Pin Count: 2; Value: 10k; Status: Not recommended; Power: 0.0625W; Tolerance: ±1%; Manufacturer Part Number: R0402_10K_1%_0.0625W_100PPM; Case: 0402; Mounted: Yes; Socket: No; SMD: Yes; Manufacturer1 Example: YAGEO PHYCOMP; Manufacturer1 ComponentHeight: 0.4mm; HelpURL: \\cern.ch\dfs\Applications\Altium\Datasheets\R0402_Phycomp_RC0402.pdf; Author: CERN DEM JLC; CreateDate: 3/12/2007; LatestRevisionDate: 17/10/2012
R12 R64 R65 = R0402_200R_1%_0.0625W_100PPM: Resistor - 1%; Part Description: General Purpose Thick Film Chip Resistor; Manufacturer: GENERIC; Manufacturer1 Part Number: 232270672001; TC: ±100ppm/°C; Table: Resistors SMD; Part Number: R0402_200R_1%_0.0625W_100PPM; Component Kind: Standard; Component Type: Standard; Pin Count: 2; Value: 200; Status: Not recommended; Power: 0.0625W; Tolerance: ±1%; Manufacturer Part Number: R0402_200R_1%_0.0625W_100PPM; Case: 0402; Mounted: Yes; Socket: No; SMD: Yes; Manufacturer1 Example: PHYCOMP; Manufacturer1 ComponentHeight: 0.4mm; HelpURL: \\cern.ch\dfs\Applications\Altium\Datasheets\R0402_Phycomp_RC0402.pdf; Author: CERN DEM JLC; CreateDate: 2007-12-03; LatestRevisionDate: 2008-03-13
R35 R37 R39 R42 = R0402_0R_JUMPER: as R33 on sheet Clock_circuit; Part Number: R0402_0R_JUMPER; Component Kind: Standard; Component Type: Standard; Pin Count: 2; Value: 0; Status: Not recommended; Manufacturer Part Number: R0402_0R_JUMPER; Case: 0402; Mounted: Yes; Socket: No; SMD: Yes; Manufacturer1 Example: PHYCOMP; Manufacturer1 ComponentHeight: 0.4mm; HelpURL: \\cern.ch\dfs\Applications\Altium\Datasheets\R0402_Phycomp_RC0402.pdf; Author: CERN DEM JLC; CreateDate: 2007-12-03; LatestRevisionDate: 2008-03-13